# EAGLE design MIDIWorkshopShield (EAGLE 5.10)
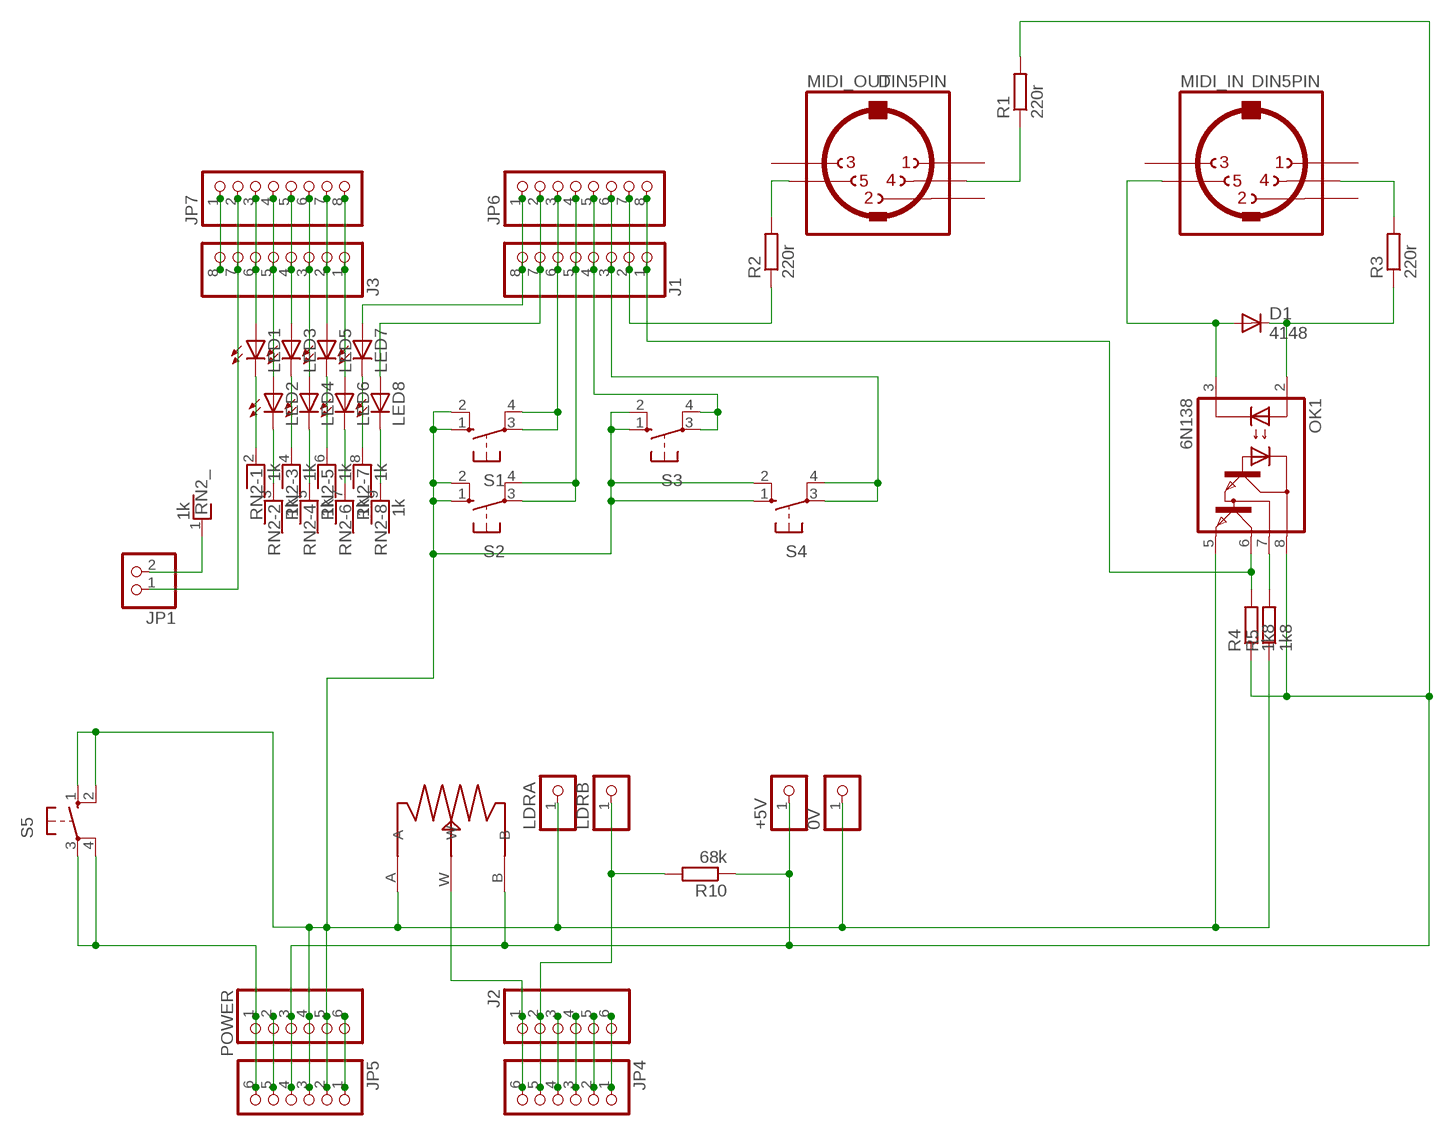
[diagram p0: schematic, sheet 1]

## Parts
0V  PINHD-1X1  [1X01]
+5V  PINHD-1X1  [1X01]
D1  4148  1N4148DO35-10  [DO35-10]
J1  PINHD-1X8  [1X08]
J2  PINHD-1X6  [1X06]
J3  PINHD-1X8  [1X08]
JP1  PINHD-1X2  [1X02]
JP4  PINHD-1X6  [1X06]
JP5  PINHD-1X6  [1X06]
JP6  PINHD-1X8  [1X08]
JP7  PINHD-1X8  [1X08]
LDRA  PINHD-1X1  [1X01]
LDRB  PINHD-1X1  [1X01]
LED1  LED3MM  [LED3MM]
LED2  LED3MM  [LED3MM]
LED3  LED3MM  [LED3MM]
LED4  LED3MM  [LED3MM]
LED5  LED3MM  [LED3MM]
LED6  LED3MM  [LED3MM]
LED7  LED3MM  [LED3MM]
LED8  LED3MM  [LED3MM]
MIDI_IN  DIN5PIN  [CHEAPYDIN]
MIDI_OUT  DIN5PIN  [CHEAPYDIN]
OK1  6N138  [DIL08]
POWER  PINHD-1X6  [1X06]
R1  220r  R-EU_0207/10  [0207/10]
R2  220r  R-EU_0207/10  [0207/10]
R3  220r  R-EU_0207/10  [0207/10]
R4  1k8  R-EU_0207/10  [0207/10]
R5  1k8  R-EU_0207/10  [0207/10]
R10  68k  R-EU_0207/10  [0207/10]
RN2  1k  RNX8  [RN-9]
S1  10-XX  [B3F-10XX]
S2  10-XX  [B3F-10XX]
S3  10-XX  [B3F-10XX]
S4  10-XX  [B3F-10XX]
S5  10-XX  [B3F-10XX]
U$1  SMALLPOT  [SMALLPOT]

## Nets
GND: 0V.1 JP5.2 JP5.3 LDRA.1 OK1.5(GND) POWER.4 POWER.5 R5.1 S1.1(S) S1.2(S1) S2.1(S) S2.2(S1) S3.1(S) S3.2(S1) S4.1(S) S4.2(S1) S5.1(S) S5.2(S1) U$1.A
N$1: MIDI_OUT.4 R1.1
N$3: J1.2 JP6.7 R2.1
N$4: D1.A MIDI_IN.5 OK1.3(C)
N$5: MIDI_IN.4 R3.2
N$6: D1.C OK1.2(A) R3.1
N$7: +5V.1 JP5.4 OK1.8(VCC) POWER.3 R1.2 R4.1 R10.1 U$1.B
N$8: J1.1 JP6.8 OK1.6(VO) R4.2
N$9: MIDI_OUT.5 R2.2
N$10: OK1.7(VB) R5.2
N$11: J3.6 JP7.3 LED1.A
N$12: J2.1 JP4.6 U$1.W
N$13: J3.5 JP7.4 LED2.A
N$14: J3.4 JP7.5 LED3.A
N$15: J3.3 JP7.6 LED4.A
N$16: J3.2 JP7.7 LED5.A
N$17: J3.1 JP7.8 LED6.A
N$18: J1.8 JP6.1 LED7.A
N$19: J1.7 JP6.2 LED8.A
N$20: J1.6 JP6.3 S1.3(P) S1.4(P1)
N$21: J1.5 JP6.4 S2.3(P) S2.4(P1)
N$22: J1.4 JP6.5 S3.3(P) S3.4(P1)
N$23: J1.3 JP6.6 S4.3(P) S4.4(P1)
N$25: LED1.K(C) RN2.2
N$26: LED2.K(C) RN2.3
N$27: LED3.K(C) RN2.4
N$28: LED4.K(C) RN2.5
N$29: LED5.K(C) RN2.6
N$30: LED6.K(C) RN2.7
N$31: LED7.K(C) RN2.8
N$32: LED8.K(C) RN2.9
N$33: JP1.2 RN2.1
N$34: J2.2 JP4.5 LDRB.1 R10.2
N$35: JP5.6 POWER.1 S5.3(P) S5.4(P1)
N$38: J3.8 JP7.1
N$39: J3.7 JP1.1 JP7.2
N$40: JP5.5 POWER.2
N$41: JP5.1 POWER.6
N$42: J2.3 JP4.4
N$43: J2.4 JP4.3
N$44: J2.5 JP4.2
N$45: J2.6 JP4.1
Unconnected: MIDI_IN.1 MIDI_IN.2 MIDI_IN.3 MIDI_OUT.1 MIDI_OUT.2 MIDI_OUT.3

## Library data of the parts
0V +5V LDRA LDRB = pinhead:PINHD-1X1: PIN HEADER
D1 = diode:1N4148: DIODE high speed (Philips)
J1 J3 JP6 JP7 = pinhead:PINHD-1X8: PIN HEADER
J2 JP4 JP5 POWER = pinhead:PINHD-1X6: PIN HEADER
JP1 = pinhead:PINHD-1X2: PIN HEADER
LED1-LED8 = adafruit:LED: LED OSRAM: - CHIPLED LG R971, LG N971, LY N971, LG Q971, LY Q971, LO R971, LY R971 LH N974, LH R974 LS Q976, LO Q976, LY Q976 LO Q996 - Hyper CHIPLED LW Q18S LB Q993, LB Q99A, LB R99A - SideLED LS A670, LO A670, LY A670, LG A670, LP A670 LB A673, LV A673, LT A673, LW A673 LH A674 LY A675 LS A676, LA A676, LO A676, LY A676, LW A676 LS A679, LY A679, LG A679 - Hyper Micro SIDELED® LS Y876, LA Y876, LO Y876, LY Y876 LT Y87S - SmartLED LW L88C, LW L88S LB L89C, LB L89S, LG L890 LS L89K, LO L89K, LY L89K LS L896, LA L896, LO L896, LY L896 - TOPLED LS T670, LO T670, LY T670, LG T670, LP T670 LSG T670, LSP T670, LSY T670, LOP T670, LYG T670 LG T671, LOG T671, LSG T671 LB T673, LV T673, LT T673, LW T673 LH T674 LS T676, LA T676, LO T676, LY T676, LB T676, LH T676, LSB T676, LW T676 LB T67C, LV T67C, LT T67C, LS T67K, LO T67K, LY T67K, LW E67C LS E67B, LA E67B, LO E67B, LY E67B, LB E67C, LV E67C, LT E67C LW T67C LS T679, LY T679, LG T679 LS T770, LO T770, LY T770, LG T770, LP T770 LB T773, LV T773, LT T773, LW T773 LH T774 LS E675, LA E675, LY E675, LS T675 LS T776, LA T776, LO T776, LY T776, LB T776 LHGB T686 LT T68C, LB T68C - Hyper Mini TOPLED® LB M676 - Mini TOPLED Santana® LG M470 LS M47K, LO M47K, LY M47K Source: http://www.osram.convergy.de/
MIDI_IN MIDI_OUT = jasons_stuff:DIN5PIN: Female CONNECTOR 5 pins 90 deg. with shield, horizontal (DIN 41524)
OK1 = optocoupler:6N138: MOTOROLA OPTO COUPLER
R1-R5 R10 = rcl:R-EU_: RESISTOR, European symbol
RN2 = resistor-net:RNX8: RESISTOR NETWORK
S1-S5 = switch-omron:10-XX: OMRON SWITCH
U$1 = jasons_stuff:SMALLPOT

## Net classes
0 default: width 0.254 mm, drill 0.305 mm, clearance 0.152 mm
1 power: width 0.61 mm, drill 0.508 mm, clearance 0.152 mm
2 gnd: width 0.305 mm, drill 0.508 mm, clearance 0.152 mm
3 usbvcc: width 0.508 mm, drill 0.508 mm, clearance 0.152 mm
4 aref: width 0.406 mm

## Board
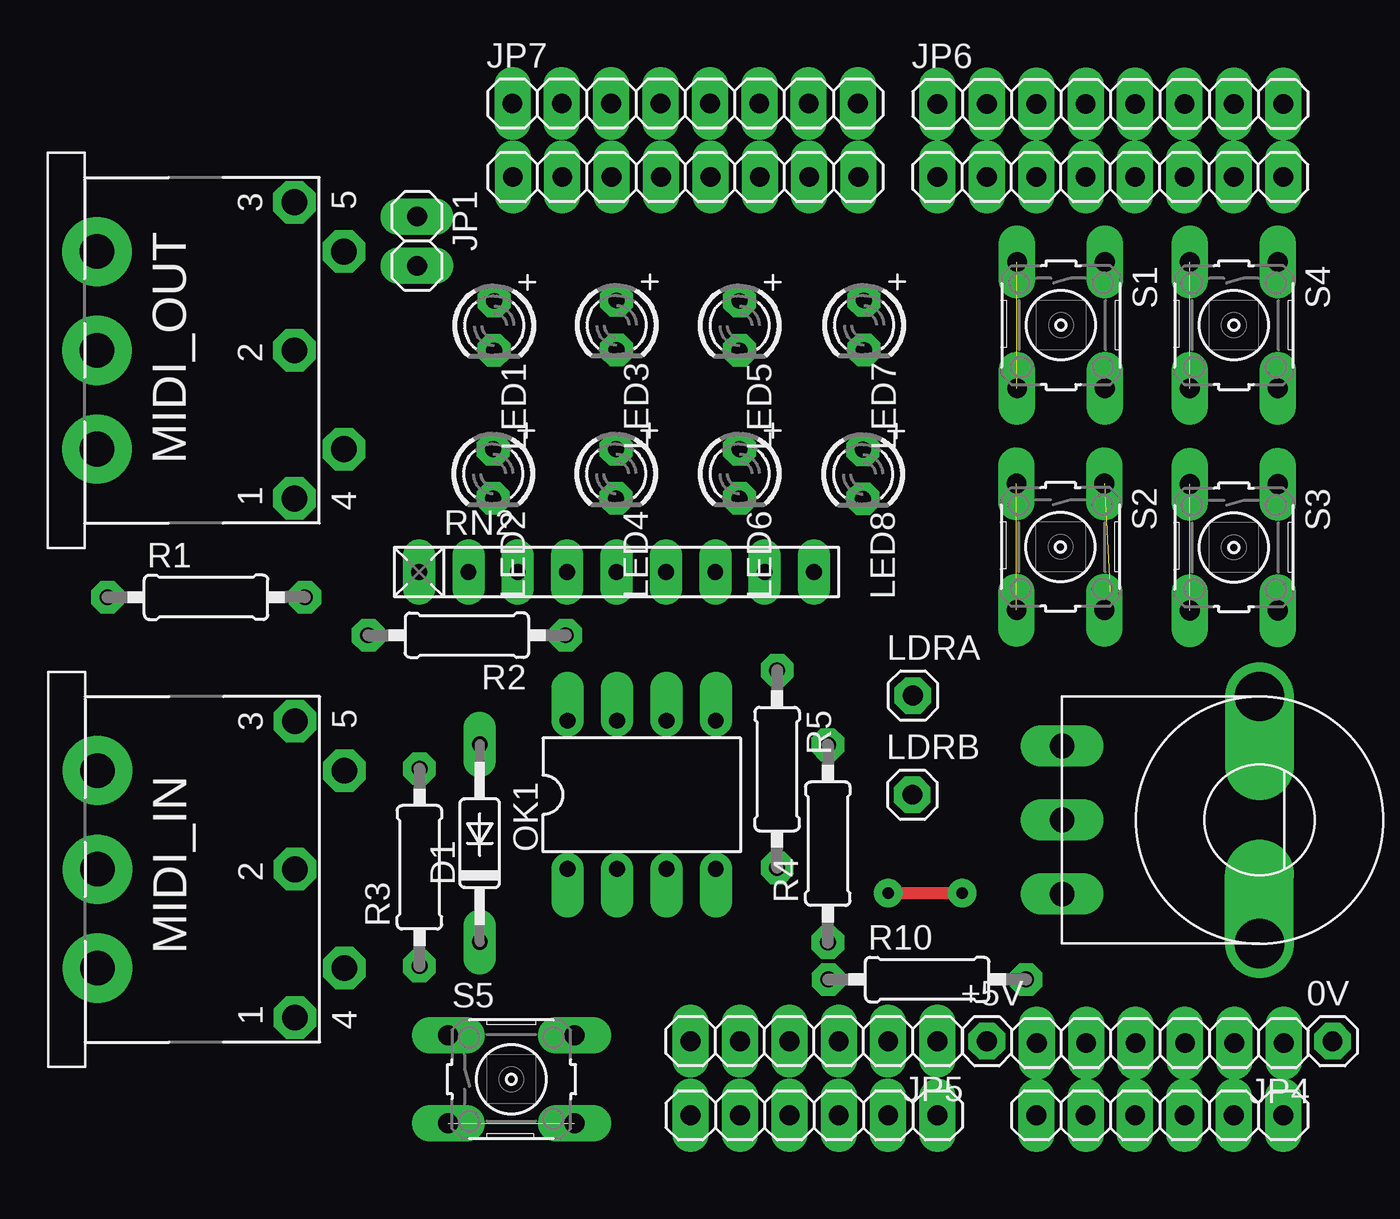
[diagram p1: board, top side]
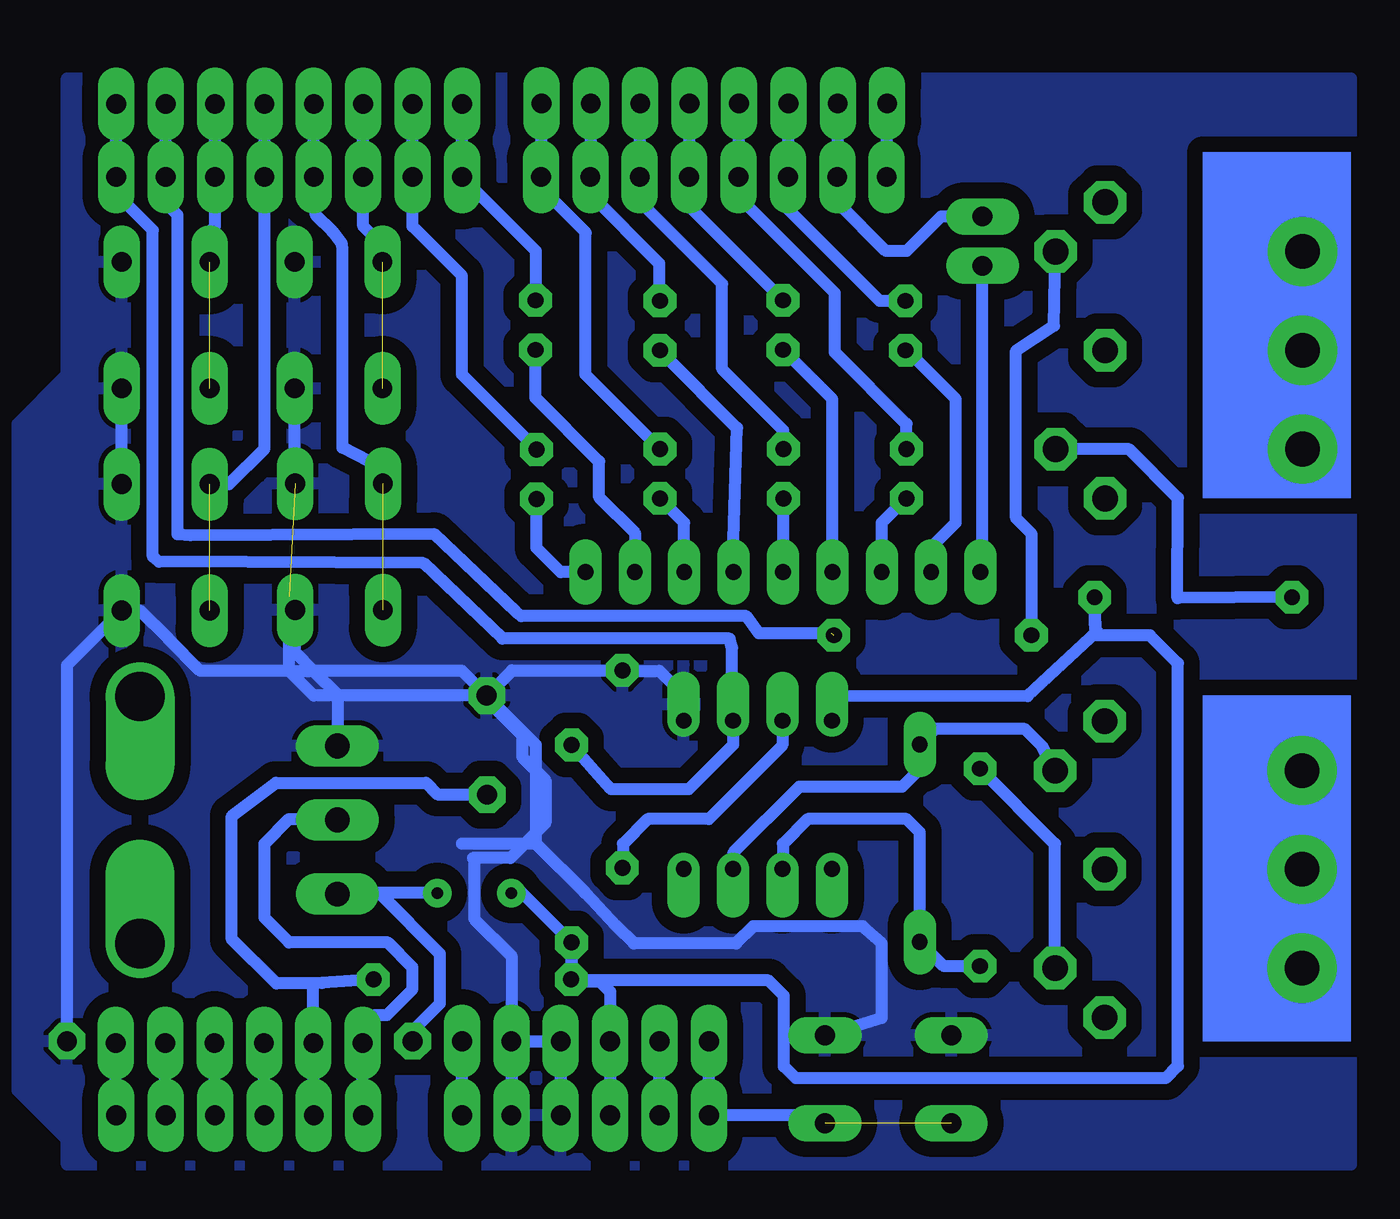
[diagram p2: board, bottom side, seen from below]

No outline drawn. Coordinates in mm, seen from the top.
Copper layers (1*16): Top 0.035mm / dielectric 1.5mm / Bottom 0.035mm
Design rules "default *": minimum track width 6mil, minimum drill 12mil, track to track 6mil, track to pad 6mil, pad to pad 6mil, via to via 6mil, smd to smd 6mil, copper to edge 30mil, drill to drill 6mil, minimum pad ring 17mil, minimum via ring 17mil, stop-mask expansion 4mil, vias tented up to drill 0mil, thermal gap 10mil

### Footprints (pad centres in the part's own frame; a part is rotated, then mirrored left to right if it is on the bottom)
1X01 = drill 1.016 octagon: 1 0,0
DO35-10 = drill 0.813 long: A 5.08,0; C -5.08,0
1X08 = drill 1.016 long: 1 -8.89,0; 2 -6.35,0; 3 -3.81,0; 4 -1.27,0; 5 1.27,0; 6 3.81,0; 7 6.35,0; 8 8.89,0
1X06 = drill 1.016 long: 1 -6.35,0; 2 -3.81,0; 3 -1.27,0; 4 1.27,0; 5 3.81,0; 6 6.35,0
1X02 = drill 1.016 long: 1 -1.27,0; 2 1.27,0
LED3MM = drill 0.813 pad 1.676 octagon: A -1.27,0; K 1.27,0
CHEAPYDIN = drill 1.321 octagon: 1 7.62,5.08; 2 0,5.08; 3 -7.62,5.08; 4 5.08,7.62; 5 -5.08,7.62 | drill 1.778 pad 3.556 round: NC -5.08,-5.08; NC1 0,-5.08; NC2 5.08,-5.08
DIL08 = drill 0.813 offset: 1 -3.81,-3.81; 2 -1.27,-3.81; 3 1.27,-3.81; 4 3.81,-3.81; 5 3.81,3.81; 6 1.27,3.81; 7 -1.27,3.81; 8 -3.81,3.81
0207/10 = drill 0.813 octagon: 1 -5.08,0; 2 5.08,0
RN-9 = drill 0.813 long: 1 -10.16,0; 2 -7.62,0; 3 -5.08,0; 4 -2.54,0; 5 0,0; 6 2.54,0; 7 5.08,0; 8 7.62,0; 9 10.16,0
B3F-10XX = drill 1.016 long: 1 -3.251,2.261; 2 3.251,2.261; 3 -3.251,-2.261; 4 3.251,-2.261
SMALLPOT = drill 1.27 pad 1.93 long: A -3.81,-10.16; B 3.81,-10.16; W 0,-10.16 | drill 2.54 pad 3.556 offset: NC1 -6.35,0; NC2 6.35,0

### Placement (x,y rotation side)
0V  66.04,6.35 0 top
+5V  48.26,6.35 0 top
D1  22.17,16.54 90 top
J1  54.61,50.8 180 top
J2  57.15,2.54 0 top
J3  32.77,50.8 180 top
JP1  18.95,47.5 270 top
JP4  57.18,6.25 180 top
JP5  39.37,6.35 180 top
JP6  54.61,54.56 0 top
JP7  32.74,54.58 0 top
LDRA  44.45,24.13 0 top
LDRB  44.42,19.02 0 top
LED1  22.91,43.15 270 top
LED2  22.86,35.53 270 top
LED3  29.21,43.18 270 top
LED4  29.18,35.53 270 top
LED5  35.53,43.15 270 top
LED6  35.53,35.53 270 top
LED7  41.94,43.18 270 top
LED8  41.88,35.51 270 top
MIDI_IN  7.59,15.19 270 top
MIDI_OUT  7.57,41.88 270 top
OK1  30.51,19.02 0 top
POWER  39.37,2.54 0 top
R1  8.1,29.18 0 top
R2  21.51,27.23 180 top
R3  19.08,15.29 90 top
R4  40.08,16.51 90 top
R5  37.47,20.35 270 top
R10  45.19,9.53 0 top
RN2  29.21,30.48 0 top
S1  52.07,43.18 270 top
S2  52.04,31.78 270 top
S3  60.96,31.75 270 top
S4  60.96,43.18 270 top
S5  23.8,4.39 0 top
U$1  62.28,17.73 270 top

### Tracks (layer width: path | path; a pad name or v marks a point on that pad's centre or on a via)
GND  (1 unrouted)
  Bottom 0.61: S1.2 54.33,35.05 S2.1 | S3.1 S4.2 | 0V.1 66.04,25.68 S3.2 63.17,28.55 62.33,28.52 60.81,27.03 59.18,25.4 54.61,25.4 | LDRA.1 41.91,21.59 41.91,16.51 | S5.2 24.13,7.54 24.13,11.38 25.12,12.27 30.73,12.27 31.62,11.38 36.88,11.38 37.77,12.27 39.37,13.97 | OK1.5 34.31,24.16 35.56,25.4 37.44,25.4 R5.1 43.16,25.43 LDRA.1 | POWER.4 JP5.3 JP5.2 | JP5.2 POWER.5 | 39.37,13.97 39.4,13.97 41.91,16.48 41.91,16.51 | 39.37,13.97 41.91,16.51 | 41.91,16.51 45.72,16.51 | 53.34,25.4 45.72,25.4 LDRA.1 | 54.61,25.4 53.34,25.4 | 53.34,25.4 54.3,26.36 S2.2 54.61,28.83 54.61,28.93 | U$1.A 52.12,24.18 53.34,25.4 | JP5.2 43.18,10.74 45.09,12.65 45.09,15.7 45.16,15.77 43.23,15.77 41.43,17.58 41.43,19.79 42.62,20.98 42.62,22.07 44.58,24.03 44.55,24.03 LDRA.1 | LDRA.1 53.34,24.13 54.61,25.4 | 54.61,25.4 54.61,28.93 | 54.61,28.93 54.61,29.21 54.25,28.85 54.25,28.57 54.61,28.93
  pour Bottom (isolate 0.813): 0,0 66.04,0 66.04,1.27 68.58,3.81 68.58,38.1 66.04,40.64 66.04,55.88 0,55.88
N$1
  Bottom 0.61: R1.1 8.91,29.13 8.89,34.29 11.4,36.8 MIDI_OUT.4
N$3  (1 unrouted)
  Bottom 0.61: JP6.7 J1.2 60.96,49.45 60.35,48.84 60.35,32.41 59.69,32.36 47.14,32.44 42.93,28.42 42.67,28.22 31.09,28.22 30.45,27.33 26.72,27.33
N$4
  Bottom 0.61: MIDI_IN.5 15.9,21.54 16.76,22.4 21.39,22.4 D1.A 22.23,21.57 22.23,20.3 23.09,19.43 28.37,19.43 31.77,16.03 OK1.3
N$5
  Bottom 0.61: MIDI_IN.4 15.21,16.51 R3.2
N$6
  Bottom 0.61: R3.1 20.93,10.21 D1.C 22.17,17.09 22.86,17.78 27.94,17.78 29.21,16.51 29.21,15.24 OK1.2
N$7  (via drill 0.6 pad 1.02)
  Top 0.61: v43.18,13.97 v46.99,13.97
  Bottom 0.61: OK1.8 26.64,24.08 16.64,24.11 13.06,27.43 13.13,27.56 R1.2 13.13,27.23 10.34,27.23 8.89,25.78 8.89,5.08 9.53,4.45 28.55,4.45 29.16,5.05 29.16,8.69 29.95,9.47 40.03,9.47 40.08,9.53 R4.1 | JP5.4 38.1,7.62 | JP5.4 POWER.3 | R4.1 40.08,11.28 | 40.08,10.92 40.06,11.38 40.06,11.25 40.01,11.3 | 40.08,11.28 40.08,10.92 | 40.08,11.28 40.06,11.3 39.98,11.3 | 40.08,10.92 40.08,9.42 | 40.08,9.42 38.63,9.42 38.1,8.89 JP5.4 | 40.08,9.42 40.11,9.5 R10.1 | +5V.1 48.26,6.88 46.86,8.28 46.86,10.85 49.94,13.92 50.8,13.92 | 50.8,13.92 U$1.B | v46.99,13.97 50.75,13.97 50.8,13.92 | v43.18,13.97 42.62,13.97 R4.1
N$8
  Bottom 0.61: R4.2 38.05,19.3 34.06,19.3 31.77,21.59 OK1.6 31.8,22.86 31.83,26.59 31.95,27.05 43.64,27.05 47.7,30.94 61.32,31.01 61.62,31.27 61.62,48.06 63.5,49.94 J1.1 JP6.8
N$9
  Bottom 0.61: MIDI_OUT.5 15.27,43.16 17.22,41.86 17.22,33.25 16.41,32.44 16.41,27.25 R2.2
N$10
  Bottom 0.61: OK1.7 29.23,21.57 33.02,17.78 36.17,17.78 37.44,16.51 37.44,15.29 R5.2
N$11
  Bottom 0.61: LED1.A 24.23,44.42 29.03,49.23 29.03,50.72 J3.6 28.93,50.83 JP7.3
N$12
  Bottom 0.61: U$1.W 52.17,17.78 54.61,17.78 55.88,16.51 55.88,12.7 54.61,11.43 49.53,11.43 48.26,10.16 48.26,9.02 49.58,7.7 50.19,7.7 50.27,7.62 50.8,7.62 50.8,6.27 JP4.6 50.83,2.56 J2.1
N$13
  Bottom 0.61: 22.86,36.78 LED2.A 22.86,38.1 26.54,41.78 26.54,44.83 31.5,49.78 J3.5 31.47,50.83 JP7.4
N$14
  Bottom 0.61: LED3.A 29.21,44.48 34.06,49.33 34.06,50.77 J3.4 34.01,50.83 JP7.5
N$15
  Bottom 0.61: LED4.A 29.18,37.77 32.33,40.92 32.33,45.31 36.55,49.53 36.55,50.77 J3.3 36.55,50.83 JP7.6
N$16
  Bottom 0.61: LED5.A 35.56,44.45 35.56,46.35 39.12,49.91 J3.2 39.09,50.83 JP7.7
N$17
  Bottom 0.61: LED6.A 39.37,40.64 39.37,47.9 39.34,47.93 41.88,50.47 41.91,50.55 J3.1 41.63,50.83 JP7.8
N$18
  Bottom 0.61: JP6.1 J1.8 41.91,46.99 41.91,44.48 LED7.A
N$19
  Bottom 0.61: JP6.2 J1.7 48.26,48.26 45.72,45.72 45.72,40.64 41.88,36.8 LED8.A
N$20  (1 unrouted)
  Bottom 0.61: S1.3 49.81,47.27 50.8,48.26 J1.6 JP6.3
N$21  (1 unrouted)
  Bottom 0.61: S2.3 49.78,35.81 51.87,36.88 51.87,47.04 51.89,47.37 52.35,47.98 52.38,47.98 53.24,48.84 53.24,50.7 J1.5 | J1.5 53.34,49.53 | J1.5 JP6.4
N$22  (1 unrouted)
  Bottom 0.61: S3.3 57.71,35 55.88,36.83 J1.4 JP6.5
N$23  (1 unrouted)
  Bottom 0.61: S4.3 58.7,47.98 58.42,48.26 J1.3 JP6.6
N$25
  Bottom 0.61: LED1.K 22.84,41.88 20.32,39.37 20.32,33.02 21.59,31.75 RN2.2
N$26
  Bottom 0.61: LED2.K 22.94,34.21 24.13,33.02 RN2.3
N$27
  Bottom 0.61: RN2.4 26.67,39.37 LED3.K
N$28
  Bottom 0.61: LED4.K 29.18,30.5 RN2.5
N$29
  Bottom 0.61: LED5.K 35.31,41.63 31.57,37.9 31.8,30.53 RN2.6
N$30
  Bottom 0.61: LED6.K 34.29,33.02 RN2.7
N$31
  Bottom 0.61: LED7.K 41.94,39.45 38.66,36.17 38.66,34.31 36.8,32.46 36.8,30.5 RN2.8
N$32
  Bottom 0.61: LED8.K 41.88,31.73 40.64,30.48 RN2.9
N$33
  Bottom 0.61: JP1.2 18.95,30.58 RN2.1
N$34
  Bottom 0.61: 53.39,9.32 JP4.5 53.37,2.56 J2.2 | 53.39,9.32 55.27,9.32 57.56,11.58 57.56,17.93 55.3,19.63 47.57,19.63 46.99,19.05 44.45,19.05 LDRB.1 | R10.2 52.93,9.35 53.39,9.32
N$35  (1 unrouted)
  Bottom 0.61: JP5.6 POWER.1 27.46,2.54 S5.4
N$38
  Bottom 0.61: JP7.1 23.85,50.83 J3.8
N$39
  Bottom 0.61: JP1.1 21.08,48.77 22.86,46.99 23.9,46.99 26.39,49.48 26.39,50.77 J3.7 26.39,50.83 JP7.2
N$40
  Bottom 0.61: POWER.2 JP5.5
N$41
  Bottom 0.61: POWER.6 JP5.1
N$42
  Bottom 0.61: JP4.4 55.91,2.56 J2.3
N$43
  Bottom 0.61: JP4.3 58.45,2.56 J2.4
N$44
  Bottom 0.61: JP4.2 60.98,2.56 J2.5
N$45
  Bottom 0.61: JP4.1 63.52,2.56 J2.6
(copper drawn outside any net)
  shapes: Bottom area x2